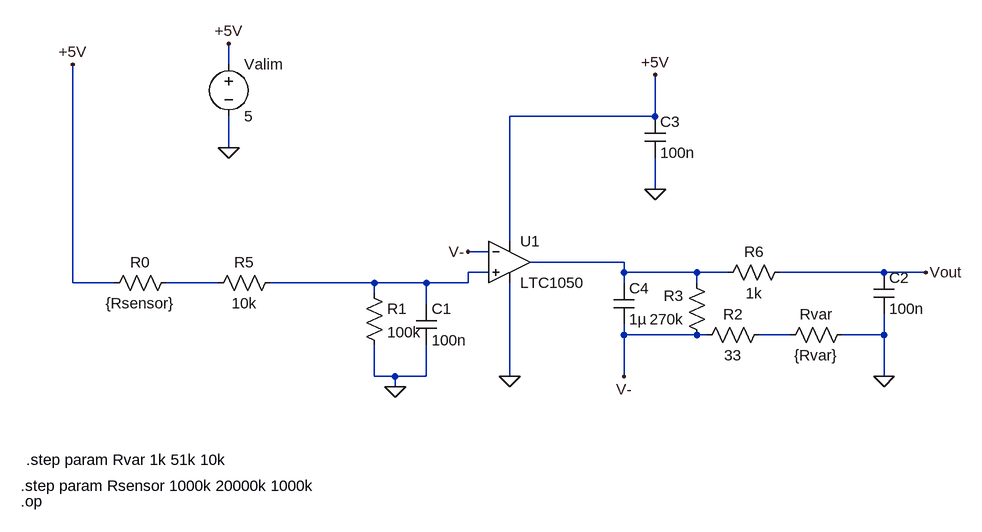
[diagram p0: schematic Draft2.asc]
Draft2.asc, the LTspice schematic file:
Version 4
SHEET 1 936 680
WIRE -208 -144 -208 -176
WIRE 448 -64 448 -128
WIRE 448 -64 224 -64
WIRE -208 -16 -208 -64
WIRE 448 48 448 0
WIRE 224 128 224 -64
WIRE 192 144 160 144
WIRE 400 160 256 160
WIRE 192 176 160 176
WIRE 400 176 400 160
WIRE 512 176 400 176
WIRE 560 176 512 176
WIRE 800 176 640 176
WIRE 864 176 800 176
WIRE -448 192 -448 -144
WIRE -384 192 -448 192
WIRE -224 192 -304 192
WIRE 16 192 -144 192
WIRE 96 192 16 192
WIRE 160 192 160 176
WIRE 160 192 96 192
WIRE 400 192 400 176
WIRE 512 192 512 176
WIRE 16 208 16 192
WIRE 96 224 96 192
WIRE 400 272 400 256
WIRE 512 272 400 272
WIRE 528 272 512 272
WIRE 656 272 608 272
WIRE 800 272 800 240
WIRE 800 272 736 272
WIRE 16 336 16 288
WIRE 48 336 16 336
WIRE 96 336 96 288
WIRE 96 336 48 336
WIRE 224 336 224 192
WIRE 400 336 400 272
WIRE 800 336 800 272
WIRE 48 352 48 336
FLAG 864 176 Vout
FLAG 224 336 0
FLAG 48 352 0
FLAG 800 336 0
FLAG 448 48 0
FLAG 448 -128 +5V
FLAG -448 -144 +5V
FLAG -208 -176 +5V
FLAG -208 -16 0
FLAG 400 336 V-
FLAG 160 144 V-
SYMBOL OpAmps\\LTC1050 224 96 R0
SYMATTR InstName U1
SYMBOL res 0 192 R0
SYMATTR InstName R1
SYMATTR Value 100k
SYMBOL res 624 256 R90
WINDOW 0 0 56 VBottom 2
WINDOW 3 32 56 VTop 2
SYMATTR InstName R2
SYMATTR Value 33
SYMBOL res 528 288 R180
WINDOW 0 36 76 Left 2
WINDOW 3 36 40 Left 2
SYMATTR InstName R3
SYMATTR Value 270k
SYMBOL res -400 208 R270
WINDOW 0 32 56 VTop 2
WINDOW 3 0 56 VBottom 2
SYMATTR InstName R0
SYMATTR Value {Rsensor}
SYMBOL res -240 208 R270
WINDOW 0 32 56 VTop 2
WINDOW 3 0 56 VBottom 2
SYMATTR InstName R5
SYMATTR Value 10k
SYMBOL cap 80 224 R0
SYMATTR InstName C1
SYMATTR Value 100n
SYMBOL cap 784 176 R0
SYMATTR InstName C2
SYMATTR Value 100n
SYMBOL cap 432 -64 R0
SYMATTR InstName C3
SYMATTR Value 100n
SYMBOL cap 384 192 R0
SYMATTR InstName C4
SYMATTR Value 1µ
SYMBOL res 656 160 R90
WINDOW 0 0 56 VBottom 2
WINDOW 3 32 56 VTop 2
SYMATTR InstName R6
SYMATTR Value 1k
SYMBOL res 752 256 R90
WINDOW 0 0 56 VBottom 2
WINDOW 3 32 56 VTop 2
SYMATTR InstName Rvar
SYMATTR Value {Rvar}
SYMBOL voltage -208 -160 R0
WINDOW 123 0 0 Left 0
WINDOW 39 0 0 Left 0
SYMATTR InstName Valim
SYMATTR Value 5
TEXT -528 504 Left 2 !.step param Rsensor 1000k 20000k 1000k
TEXT -528 528 Left 2 !.op
TEXT -520 464 Left 2 !.step param Rvar 1k 51k 10k

The netlist it stands for:
* Draft2.asc
XU1 N002 V- +5V 0 N001 LTC1050  ; pins In+ In- V+ V- OUT
R1 N002 0 100k
R2 N004 V- 33
R3 V- N001 270k
R0 +5V N003 {Rsensor}
R5 N003 N002 10k
C1 N002 0 100n
C2 Vout 0 100n
C3 +5V 0 100n
C4 N001 V- 1µ
R6 Vout N001 1k
Rvar 0 N004 {Rvar}
Valim +5V 0 5
.step param Rsensor 1000k 20000k 1000k
.op
.step param Rvar 1k 51k 10k
.lib LTC.lib
.backanno
.end